# EAGLE design Layout (EAGLE 9.3.2)
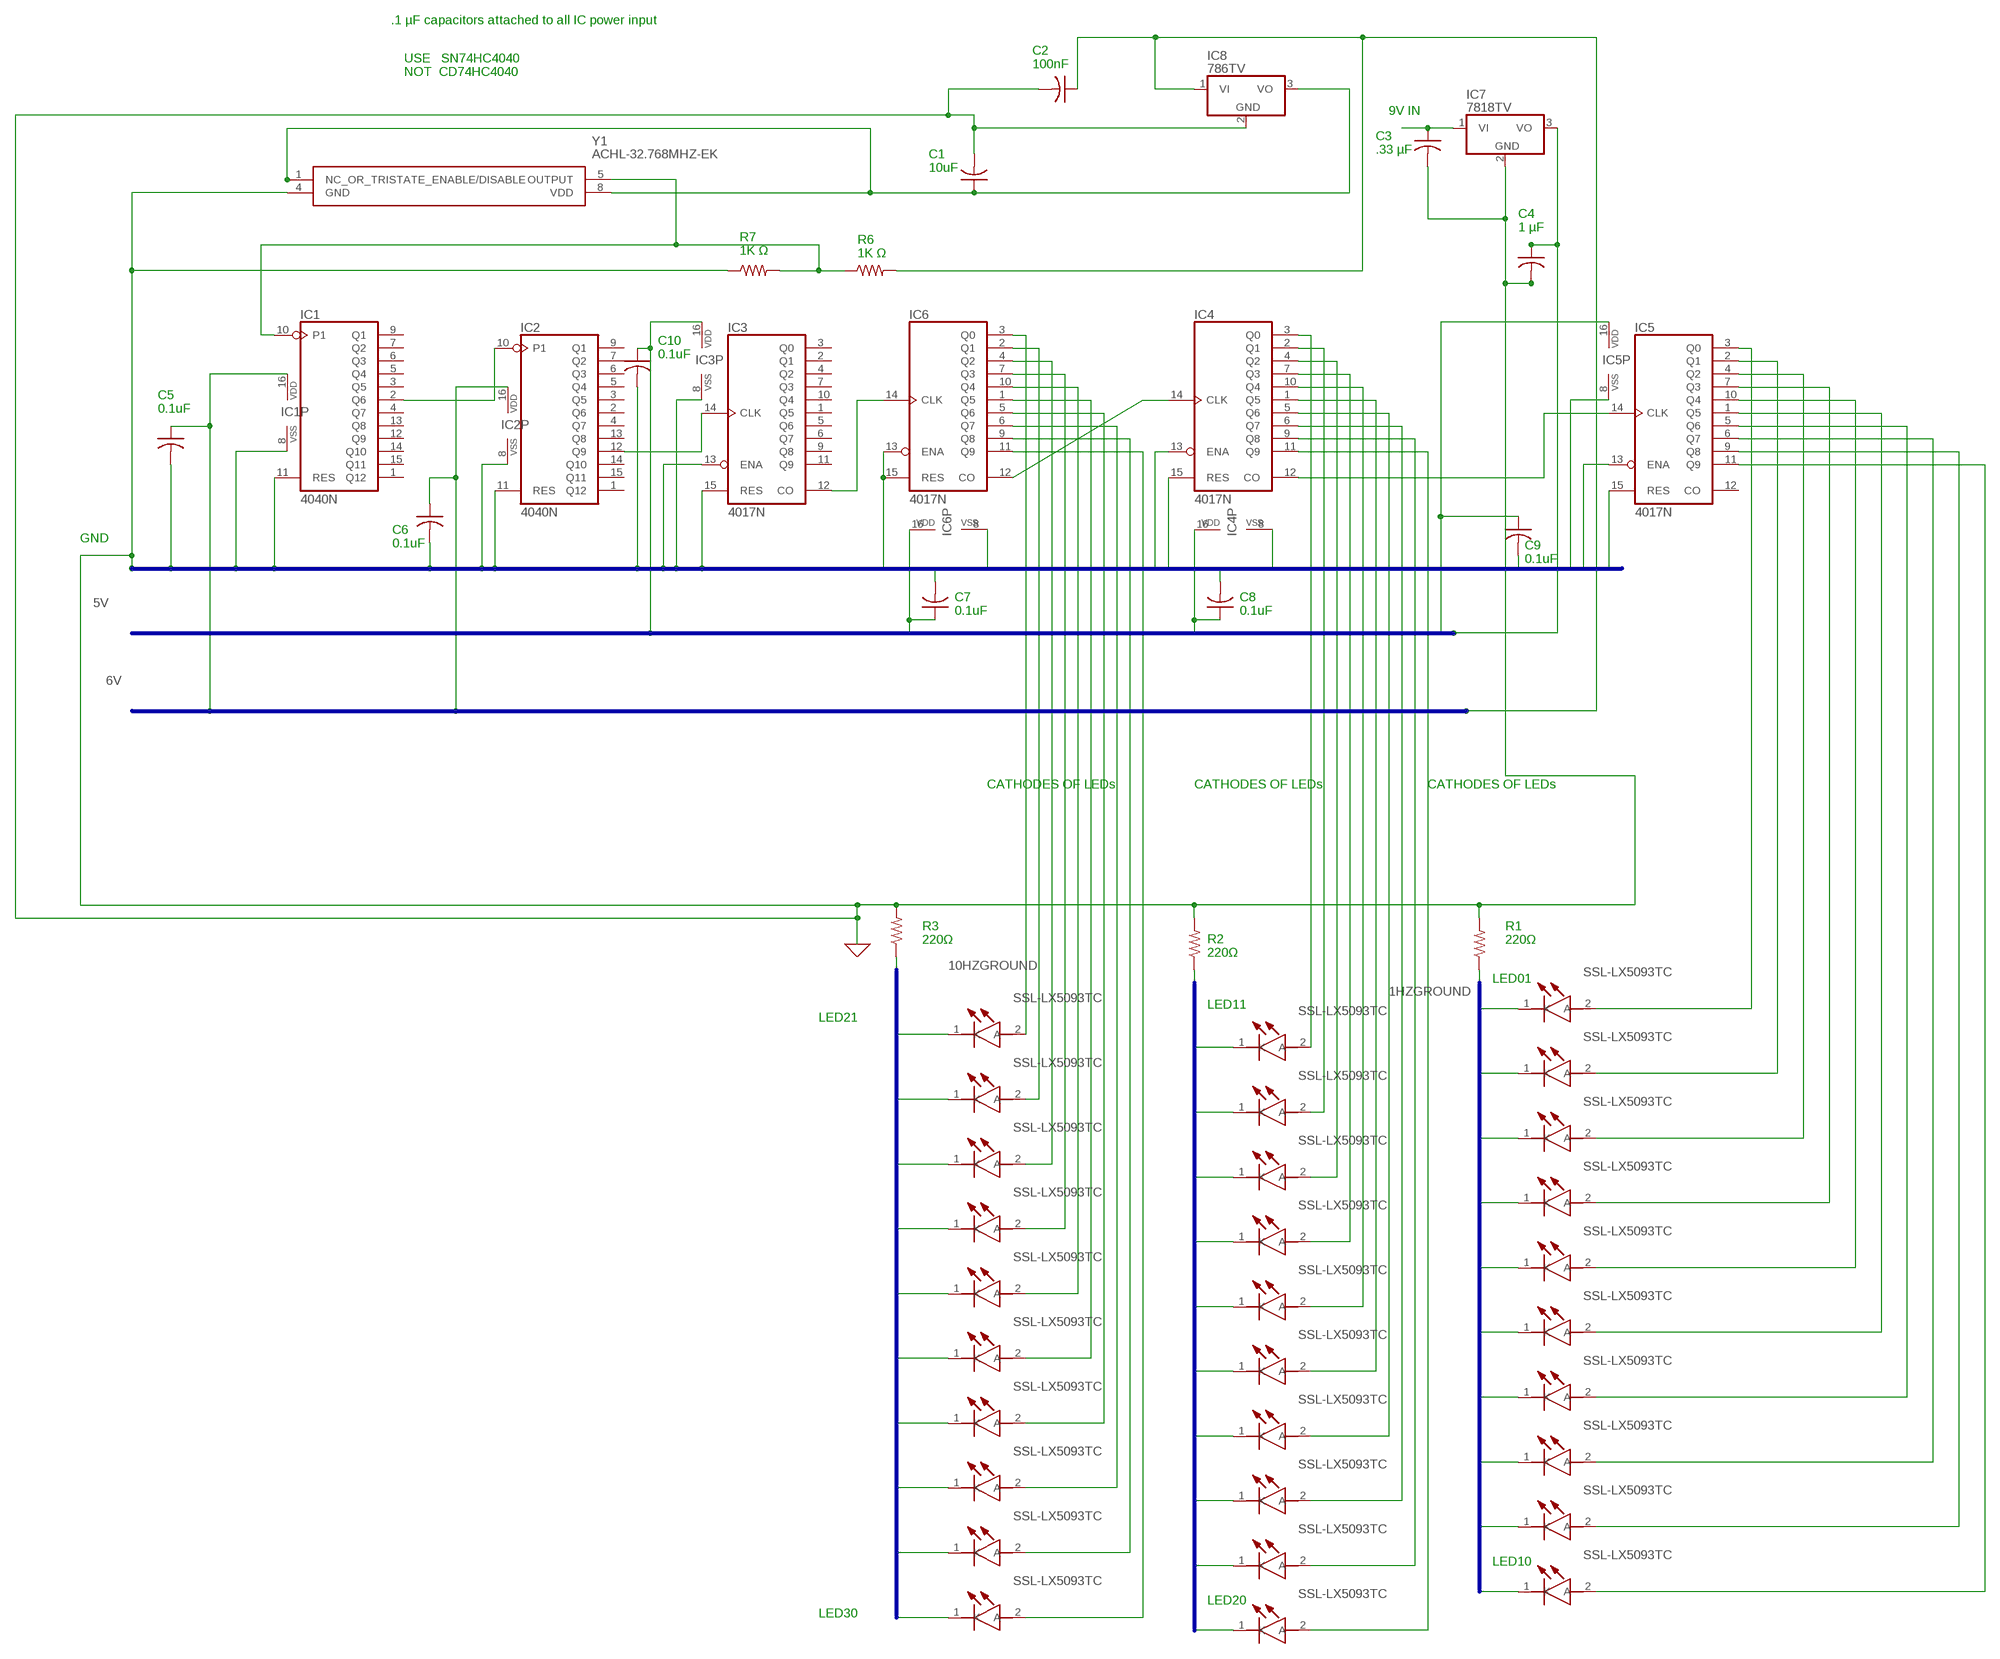
[diagram p0: schematic, sheet 1]

## Parts
C1  1uF  C-US075-063X106  [C075-063X106]
C2  .33uF  C-US075-063X106  [C075-063X106]
C3  0.33uF  C-US075-063X106  [C075-063X106]
C4  1uF  C-US075-063X106  [C075-063X106]
C5  .1uF  C-US075-063X106  [C075-063X106]
C6  .1uF  C-US075-063X106  [C075-063X106]
C7  .1uF  C-US075-063X106  [C075-063X106]
C8  .1uF  C-US075-063X106  [C075-063X106]
C9  .1uF  C-US075-063X106  [C075-063X106]
C10  .1uF  C-US075-063X106  [C075-063X106]
IC1  4040N  [DIL16]
IC2  4040N  [DIL16]
IC3  4017N  [DIL16]
IC4  4017N  [DIL16]
IC5  4017N  [DIL16]
IC6  4017N  [DIL16]
IC7  7818TV  [TO220V]
IC8  786TV  [TO220V]
LED1  SSL-LX5093TC  [SSL-LX5093SGC/B]
LED2  SSL-LX5093TC  [SSL-LX5093SGC/B]
LED3  SSL-LX5093TC  [SSL-LX5093SGC/B]
LED4  SSL-LX5093TC  [SSL-LX5093SGC/B]
LED5  SSL-LX5093TC  [SSL-LX5093SGC/B]
LED6  SSL-LX5093TC  [SSL-LX5093SGC/B]
LED7  SSL-LX5093TC  [SSL-LX5093SGC/B]
LED8  SSL-LX5093TC  [SSL-LX5093SGC/B]
LED9  SSL-LX5093TC  [SSL-LX5093SGC/B]
LED10  SSL-LX5093TC  [SSL-LX5093SGC/B]
LED11  SSL-LX5093TC  [SSL-LX5093SGC/B]
LED12  SSL-LX5093TC  [SSL-LX5093SGC/B]
LED13  SSL-LX5093TC  [SSL-LX5093SGC/B]
LED14  SSL-LX5093TC  [SSL-LX5093SGC/B]
LED15  SSL-LX5093TC  [SSL-LX5093SGC/B]
LED16  SSL-LX5093TC  [SSL-LX5093SGC/B]
LED17  SSL-LX5093TC  [SSL-LX5093SGC/B]
LED18  SSL-LX5093TC  [SSL-LX5093SGC/B]
LED19  SSL-LX5093TC  [SSL-LX5093SGC/B]
LED20  SSL-LX5093TC  [SSL-LX5093SGC/B]
LED21  SSL-LX5093TC  [SSL-LX5093SGC/B]
LED22  SSL-LX5093TC  [SSL-LX5093SGC/B]
LED23  SSL-LX5093TC  [SSL-LX5093SGC/B]
LED24  SSL-LX5093TC  [SSL-LX5093SGC/B]
LED25  SSL-LX5093TC  [SSL-LX5093SGC/B]
LED26  SSL-LX5093TC  [SSL-LX5093SGC/B]
LED27  SSL-LX5093TC  [SSL-LX5093SGC/B]
LED28  SSL-LX5093TC  [SSL-LX5093SGC/B]
LED29  SSL-LX5093TC  [SSL-LX5093SGC/B]
LED30  SSL-LX5093TC  [SSL-LX5093SGC/B]
R1  220  R-US_0207/12  [0207/12]
R2  220  R-US_0207/12  [0207/12]
R3  220  R-US_0207/12  [0207/12]
R6  1k  R-US_0309/12  [0309/12]
R7  1k  R-US_0309/12  [0309/12]
Y1  ACHL-32.768MHZ-EK  [ACHL]

## Nets
1HZGROUND: LED1.1(K) LED2.1(K) LED3.1(K) LED4.1(K) LED5.1(K) LED6.1(K) LED7.1(K) LED8.1(K) LED9.1(K) LED10.1(K) R1.1
3.3: C1.1 IC8.3(VO) Y1.1(NC_OR_TRISTATE_ENABLE/DISABLE) Y1.8(VDD)
5V: C4.1 C7.1 C8.1 C9.1 C10.1 IC3.16(VDD) IC4.16(VDD) IC5.16(VDD) IC6.16(VDD) IC7.3(VO)
6V: C2.1 C5.1 C6.1 IC1.16(VDD) IC2.16(VDD) IC8.1(VI) R6.2
9V: C3.1 IC7.1(VI)
10HZGROUND: LED11.1(K) LED12.1(K) LED13.1(K) LED14.1(K) LED15.1(K) LED16.1(K) LED17.1(K) LED18.1(K) LED19.1(K) LED20.1(K) R2.1
100HZGROUND: LED21.1(K) LED22.1(K) LED23.1(K) LED24.1(K) LED25.1(K) LED26.1(K) LED27.1(K) LED28.1(K) LED29.1(K) LED30.1(K) R3.1
C1: IC4.12(CO) IC5.14(CLK)
C1K: IC2.12(Q9) IC3.14(CLK)
C10: IC4.14(CLK) IC6.12(CO)
C32: IC1.10(P1) R6.1 R7.2 Y1.5(OUTPUT)
C100: IC3.12(CO) IC6.14(CLK)
C512: IC1.2(Q6) IC2.10(P1)
LED1: IC5.3(Q0) LED1.2(A)
LED2: IC5.2(Q1) LED2.2(A)
LED3: IC5.4(Q2) LED3.2(A)
LED4: IC5.7(Q3) LED4.2(A)
LED5: IC5.10(Q4) LED5.2(A)
LED6: IC5.1(Q5) LED6.2(A)
LED7: IC5.5(Q6) LED7.2(A)
LED8: IC5.6(Q7) LED8.2(A)
LED9: IC5.9(Q8) LED9.2(A)
LED10: IC5.11(Q9) LED10.2(A)
LED11: IC4.3(Q0) LED11.2(A)
LED12: IC4.2(Q1) LED12.2(A)
LED13: IC4.4(Q2) LED13.2(A)
LED14: IC4.7(Q3) LED14.2(A)
LED15: IC4.10(Q4) LED15.2(A)
LED16: IC4.1(Q5) LED16.2(A)
LED17: IC4.5(Q6) LED17.2(A)
LED18: IC4.6(Q7) LED18.2(A)
LED19: IC4.9(Q8) LED19.2(A)
LED20: IC4.11(Q9) LED20.2(A)
LED21: IC6.3(Q0) LED21.2(A)
LED22: IC6.2(Q1) LED22.2(A)
LED23: IC6.4(Q2) LED23.2(A)
LED24: IC6.7(Q3) LED24.2(A)
LED25: IC6.10(Q4) LED25.2(A)
LED26: IC6.1(Q5) LED26.2(A)
LED27: IC6.5(Q6) LED27.2(A)
LED28: IC6.6(Q7) LED28.2(A)
LED29: IC6.9(Q8) LED29.2(A)
LED30: IC6.11(Q9) LED30.2(A)
N$1: C1.2 C2.2 C3.2 C4.2 C5.2 C6.2 C7.2 C8.2 C9.2 C10.2 IC1.8(VSS) IC1.11(RES) IC2.8(VSS) IC2.11(RES) IC3.8(VSS) IC3.13(ENA) IC3.15(RES) IC4.8(VSS) IC4.13(ENA) IC4.15(RES) IC5.8(VSS) IC5.13(ENA) IC5.15(RES) IC6.8(VSS) IC6.13(ENA) IC6.15(RES) IC7.2(GND) IC8.2(GND) R1.2 R2.2 R3.2 R7.1 Y1.4(GND) ; supply symbol labelled GND
Unconnected: IC1.1(Q12) IC1.3(Q5) IC1.4(Q7) IC1.5(Q4) IC1.6(Q3) IC1.7(Q2) IC1.9(Q1) IC1.12(Q9) IC1.13(Q8) IC1.14(Q10) IC1.15(Q11) IC2.1(Q12) IC2.2(Q6) IC2.3(Q5) IC2.4(Q7) IC2.5(Q4) IC2.6(Q3) IC2.7(Q2) IC2.9(Q1) IC2.13(Q8) IC2.14(Q10) IC2.15(Q11) IC3.1(Q5) IC3.2(Q1) IC3.3(Q0) IC3.4(Q2) IC3.5(Q6) IC3.6(Q7) IC3.7(Q3) IC3.9(Q8) IC3.10(Q4) IC3.11(Q9) IC5.12(CO)

## Buses
N$1
5V
6V
1HZGROUND
10HZGROUND
100HZGROUND

## Notes on the sheet
- .1 µF capacitors attached to all IC power input
- C2
  100nF
- USE   SN74HC4040
  NOT  CD74HC4040
- 9V IN
- C3
  .33 µF
- C1
  10uF
- C4
  1 µF
- R7
  1K Ω
- R6
  1K Ω
- C10
  0.1uF
- C5
  0.1uF
- GND
- C6
  0.1uF
- C9
  0.1uF
- C7
  0.1uF
- C8
  0.1uF
- CATHODES OF LEDs | CATHODES OF LEDs | CATHODES OF LEDs
- R3
  220Ω
- R1
  220Ω
- R2
  220Ω
- LED01
- LED11
- LED21
- LED10
- LED20
- LED30

## Library data of the parts
C1-C4 C6-C10 = rcl:C-US: CAPACITOR, American symbol; SPICEPREFIX: C
C5 = rcl:C-US: CAPACITOR, American symbol; C5: 0.1uF; SPICEPREFIX: C
IC1 IC2 = 40xx:4040: 12-stage binary/ripple COUNTER
IC3-IC6 = 40xx:4017: COUNTER/DIVIDER
IC7 = linear:78*: Positive VOLTAGE REGULATOR Source: http://cache.national.com/ds/LM/LM78L05.pdf http://www.fairchildsemi.com/ds/LM/LM7805.pdf; SPICEPREFIX: J
IC8 = linear:78*: Positive VOLTAGE REGULATOR Source: http://cache.national.com/ds/LM/LM78L05.pdf http://www.fairchildsemi.com/ds/LM/LM7805.pdf
LED1-LED30 = SSL-LX5093TC:SSL-LX5093TC: Lumex SSL-LX5093TC Turquoise LED, 5mm (T-1 3/4) Clear, Dome Lens Through Hole Package Source: Datasheet <https://componentsearchengine.com/Datasheets/1/SSL-LX5093TC.pdf>; DESCRIPTION: Lumex SSL-LX5093TC Turquoise LED, 5mm (T-1 3/4) Clear, Dome Lens Through Hole Package; HEIGHT: mm; MANUFACTURER_NAME: Lumex; MANUFACTURER_PART_NUMBER: SSL-LX5093TC; MOUSER_PART_NUMBER: 696-SSL-LX5093TC; MOUSER_PRICE-STOCK: https://www.mouser.com/Search/Refine.aspx?Keyword=696-SSL-LX5093TC
R1-R3 R6 R7 = rcl:R-US_: RESISTOR, American symbol; SPICEPREFIX: R
Y1 = ACHL-32.768MHZ-EK:ACHL-32.768MHZ-EK: Standard Clock Oscillators 32.768MHz 3.3V Source: Datasheet <https://abracon.com/Support/PackageDrawing/Oscillators/ACHL.PDF>; DESCRIPTION: Standard Clock Oscillators 32.768MHz 3.3V; HEIGHT: mm; MANUFACTURER_NAME: ABRACON; MANUFACTURER_PART_NUMBER: ACHL-32.768MHZ-EK; MOUSER_PART_NUMBER: 815-ACHL-32.768-EK; MOUSER_PRICE-STOCK: https://www.mouser.com/Search/Refine.aspx?Keyword=815-ACHL-32.768-EK

## Board
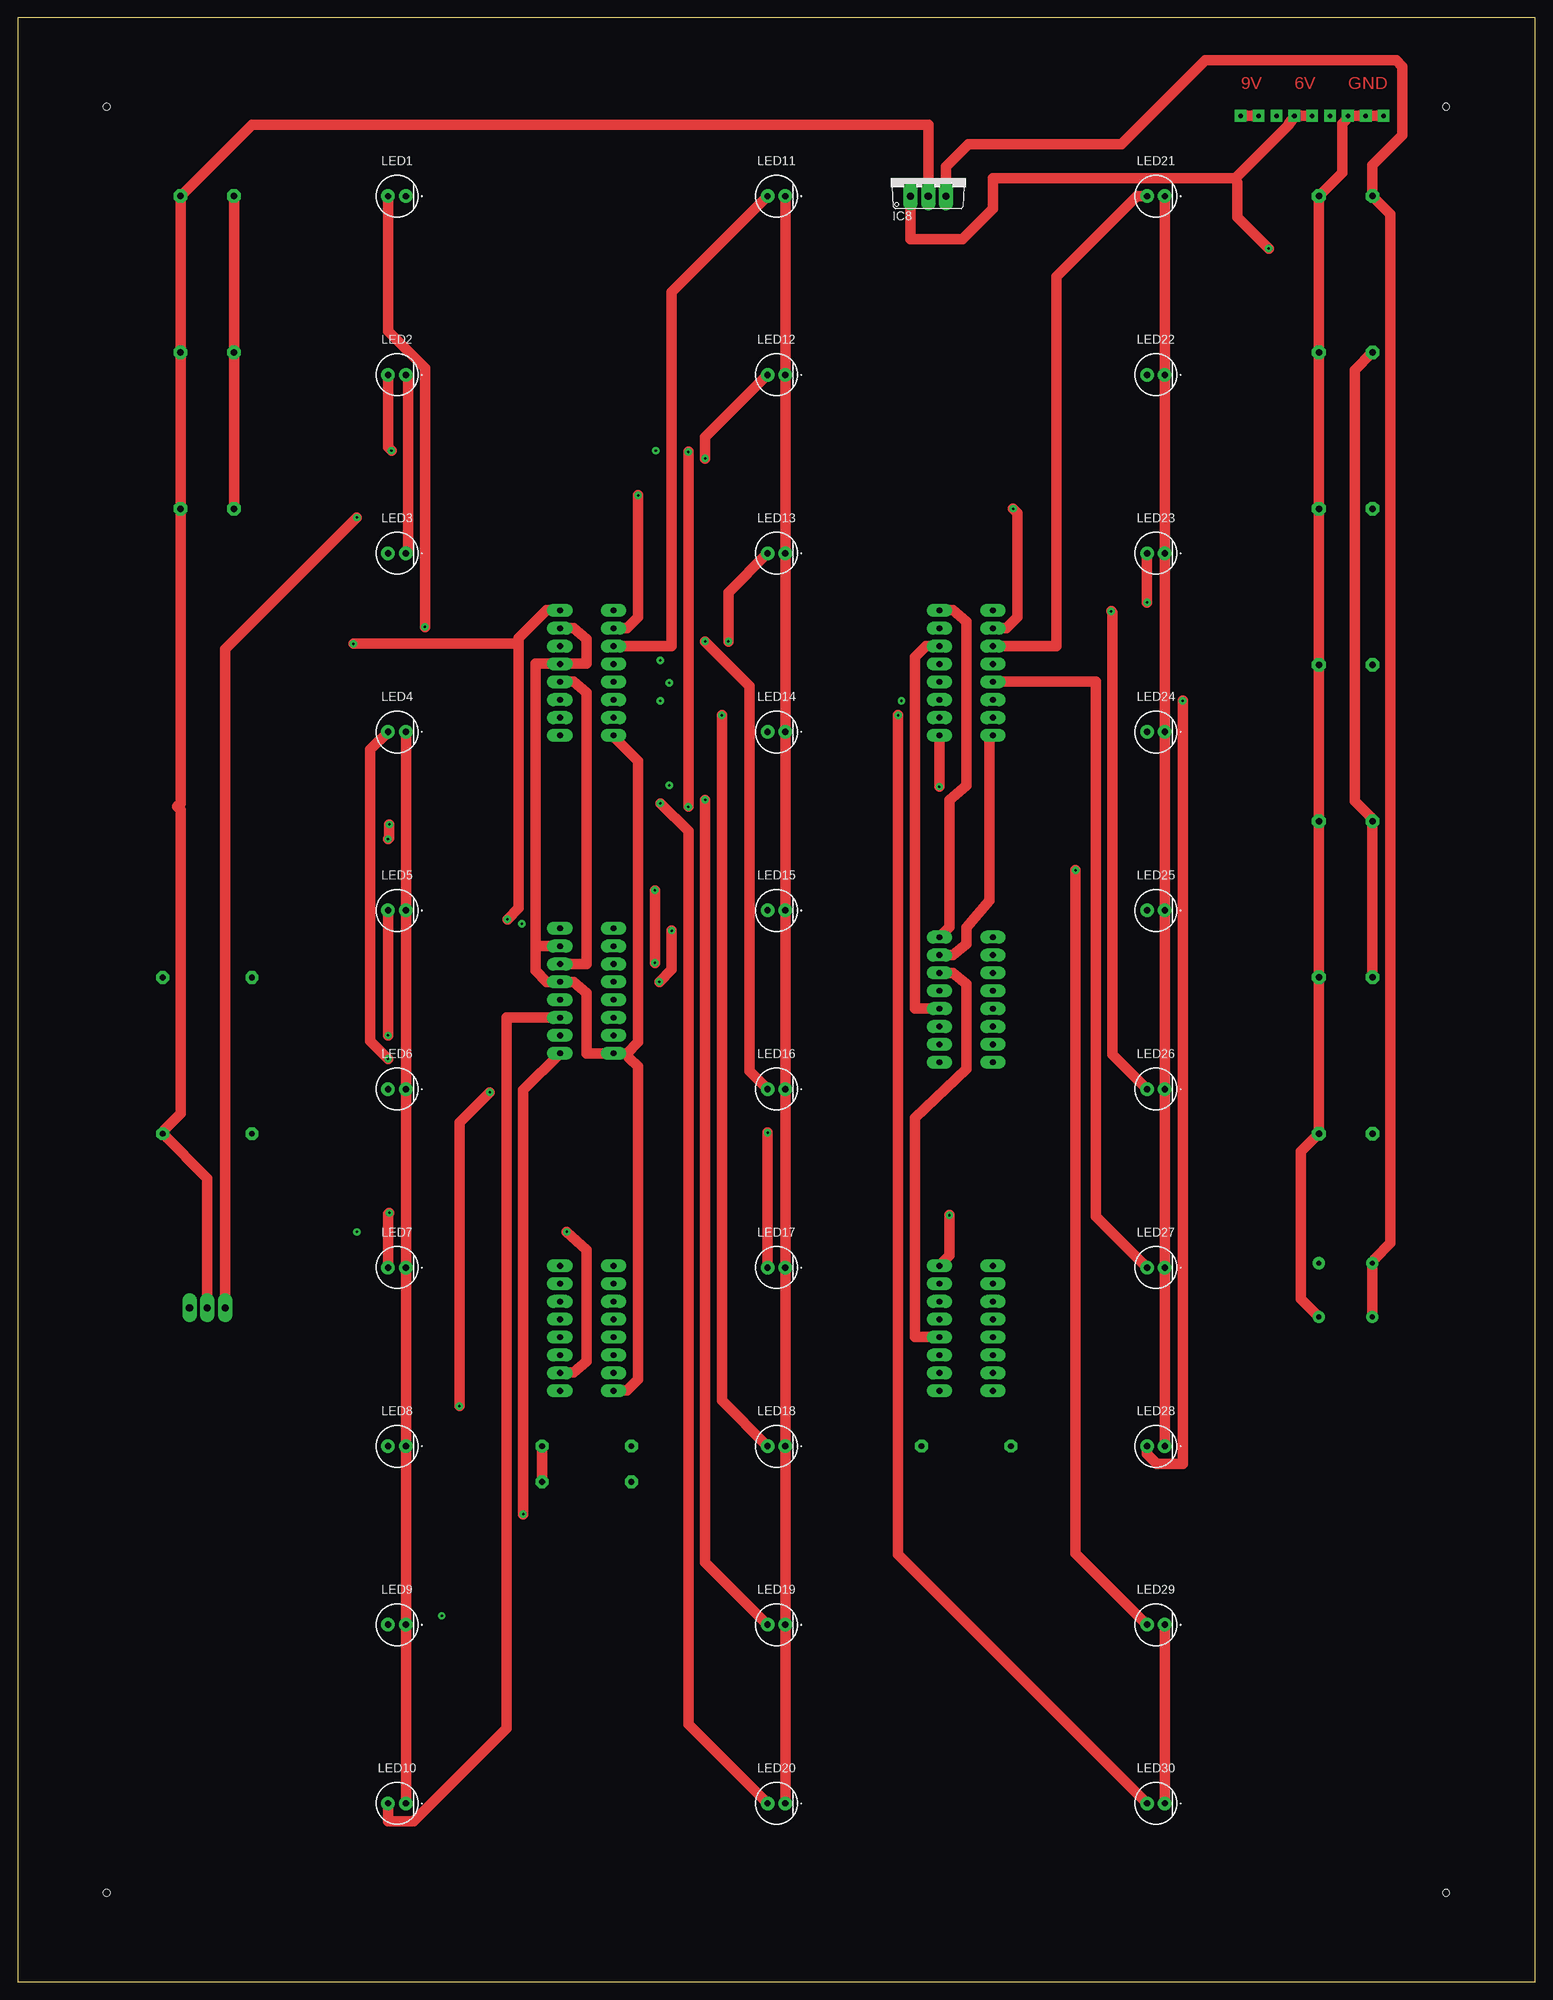
[diagram p1: board, top side]
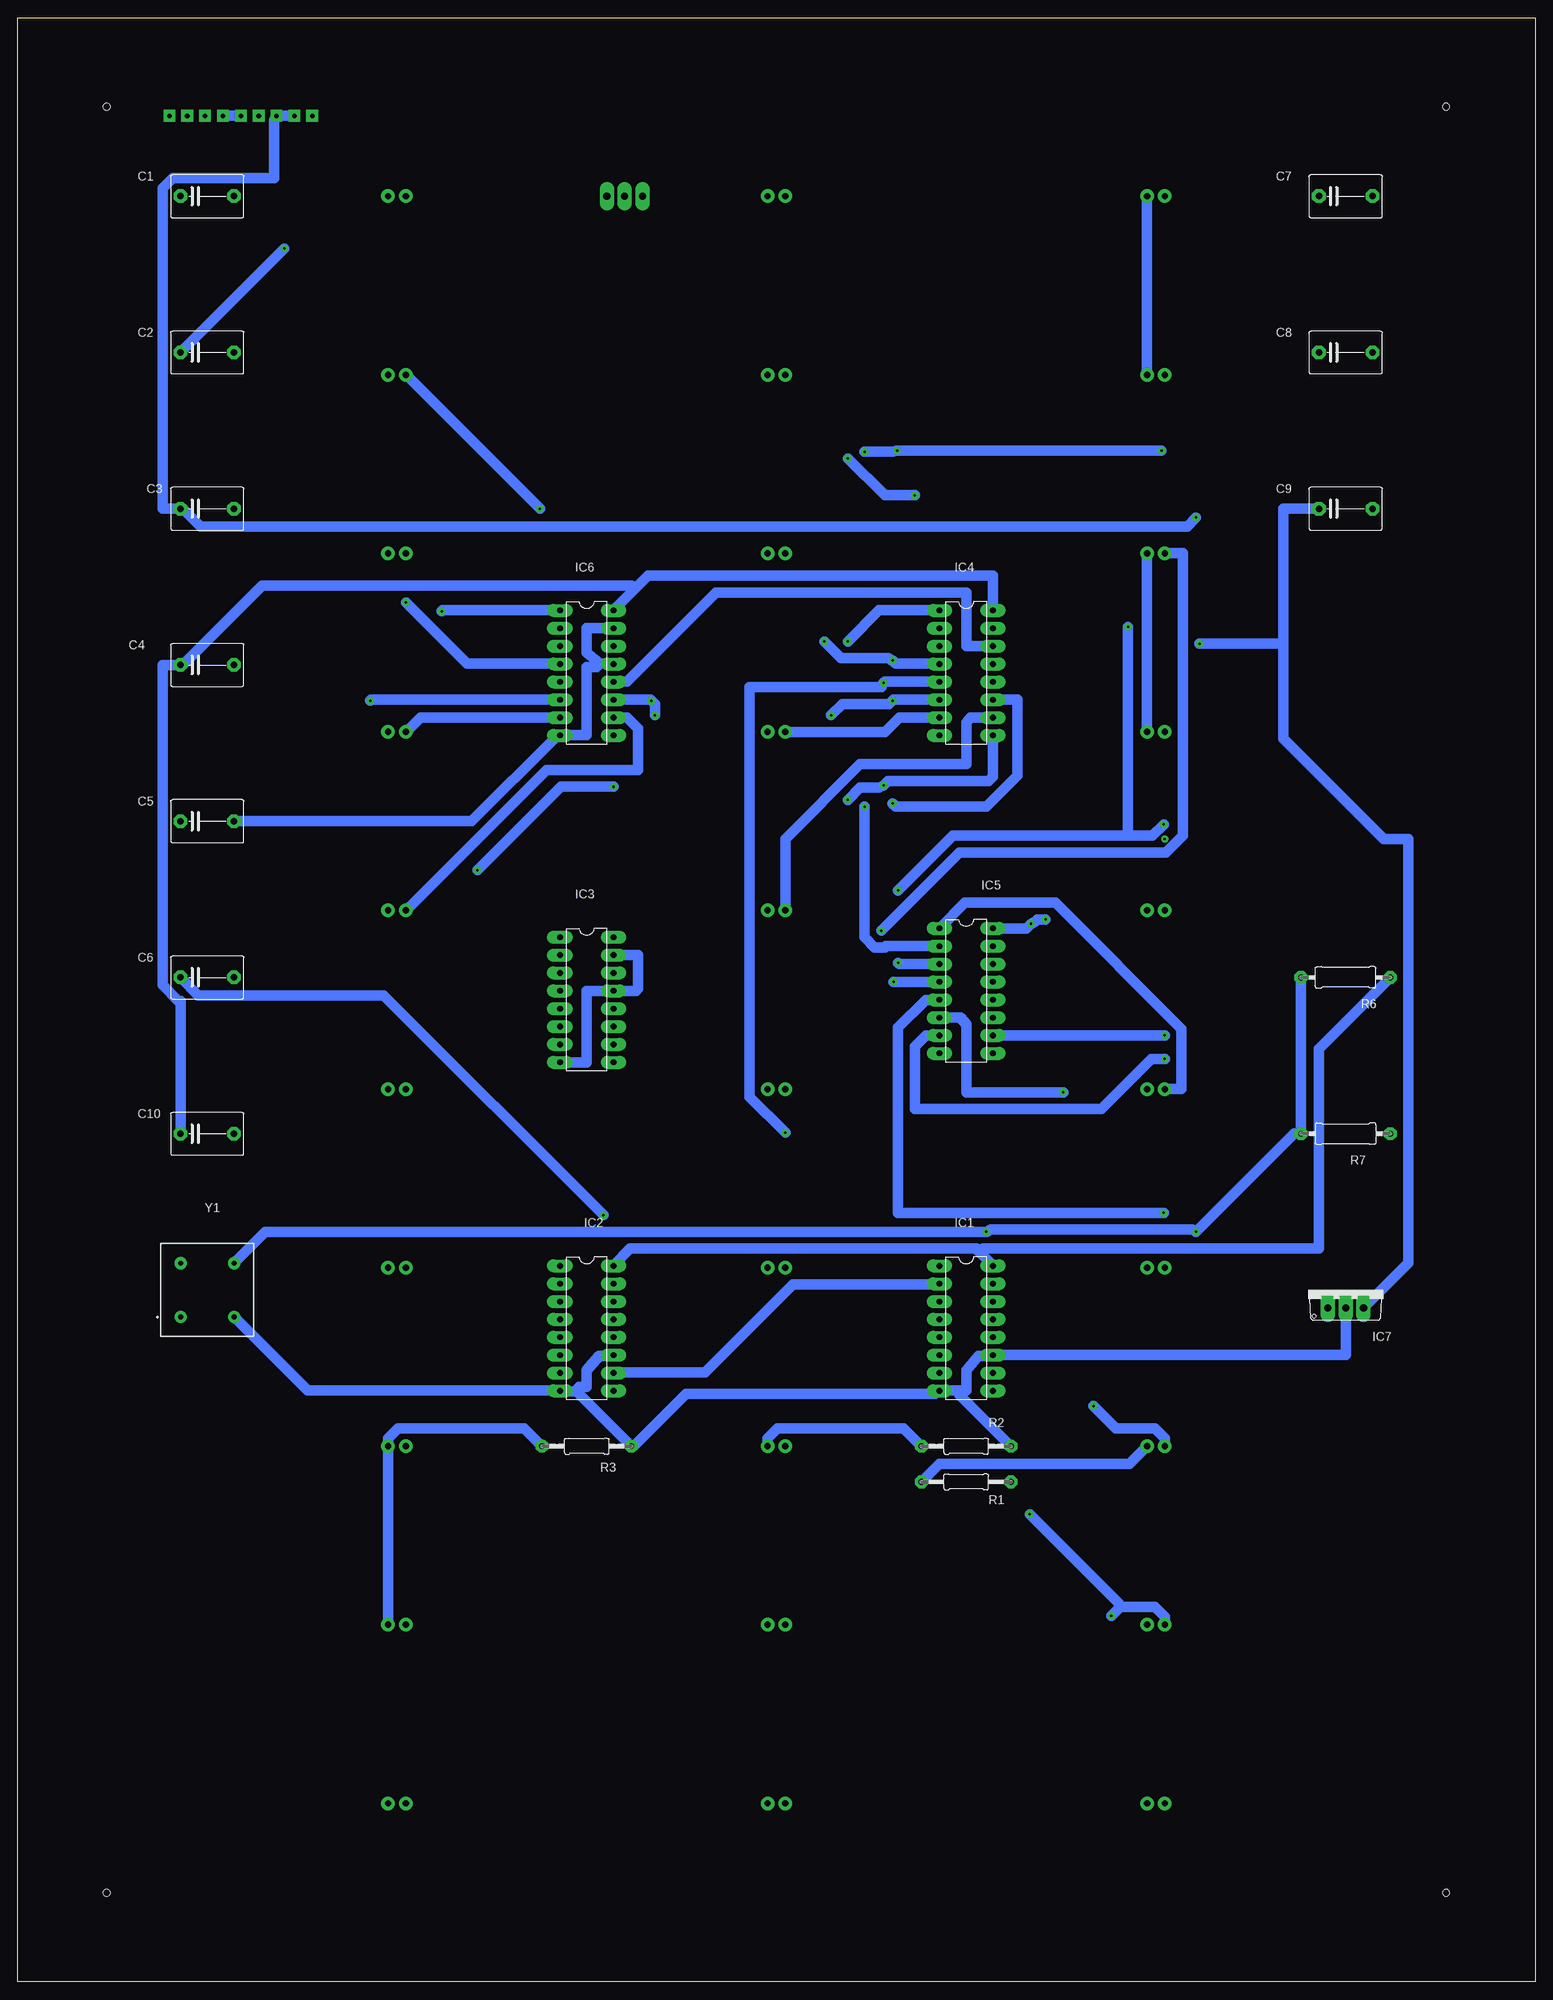
[diagram p2: board, bottom side, seen from below]

Size 215.9 x 279.4 mm. Coordinates in mm from the lower left corner, seen from the top.
Outline: 0,0 215.9,0 215.9,279.4 0,279.4 0,0
Copper layers (1*16): Top 0.035mm / dielectric 1.5mm / Bottom 0.035mm
Design rules "default *": minimum track width 60mil, minimum drill 0.35mm, track to track 30mil, track to pad 30mil, pad to pad 6mil, via to via 6mil, smd to smd 6mil, copper to edge 40mil, drill to drill 6mil, minimum pad ring 10mil, minimum via ring 8mil, stop-mask expansion 4mil, vias tented up to drill 0mil, thermal gap 10mil
Holes 1 mm at 203.2,266.7 12.7,266.7 12.7,12.7 203.2,12.7

### Footprints (pad centres in the part's own frame; a part is rotated, then mirrored left to right if it is on the bottom)
C075-063X106 = drill 0.914 octagon: 1 -3.81,0; 2 3.81,0
DIL16 = drill 0.813 long: 1 -8.89,-3.81; 2 -6.35,-3.81; 3 -3.81,-3.81; 4 -1.27,-3.81; 5 1.27,-3.81; 6 3.81,-3.81; 7 6.35,-3.81; 8 8.89,-3.81; 9 8.89,3.81; 10 6.35,3.81; 11 3.81,3.81; 12 1.27,3.81; 13 -1.27,3.81; 14 -3.81,3.81; 15 -6.35,3.81; 16 -8.89,3.81
TO220V = drill 1.016 long: 1 -2.54,-2.54; 2 0,-2.54; 3 2.54,-2.54
SSL-LX5093SGC/B = drill 0.91 pad 1.4: 1 1.27,0; 2 -1.27,0
0207/12 = drill 0.813 octagon: 1 -6.35,0; 2 6.35,0
0309/12 = drill 0.813 octagon: 1 -6.35,0; 2 6.35,0
ACHL = drill 0.7 pad 1.2: 1 -3.81,-3.81; 4 3.81,-3.81; 5 3.81,3.81; 8 -3.81,3.81

### Placement (x,y rotation side)
C1  188.91,254 0 bottom
C2  188.91,231.78 0 bottom
C3  188.91,209.55 0 bottom
C4  188.91,187.32 0 bottom
C5  188.91,165.1 0 bottom
C6  188.91,142.88 0 bottom
C7  26.99,254 0 bottom
C8  26.99,231.78 0 bottom
C9  26.99,209.55 0 bottom
C10  188.91,120.65 0 bottom
IC1  80.96,92.96 270 bottom
IC2  134.94,92.96 270 bottom
IC3  134.94,139.7 270 bottom
IC4  80.96,186.18 270 bottom
IC5  80.96,140.97 270 bottom
IC6  134.94,186.18 270 bottom
IC7  26.99,98.42 0 bottom
IC8  129.54,256.54 0 top
LED1  53.98,254 0 top
LED2  53.98,228.6 0 top
LED3  53.98,203.2 0 top
LED4  53.98,177.8 0 top
LED5  53.98,152.4 0 top
LED6  53.98,127 0 top
LED7  53.98,101.6 0 top
LED8  53.98,76.2 0 top
LED9  53.98,50.8 0 top
LED10  53.98,25.4 0 top
LED11  107.95,254 0 top
LED12  107.95,228.6 0 top
LED13  107.95,203.2 0 top
LED14  107.95,177.8 0 top
LED15  107.95,152.4 0 top
LED16  107.95,127 0 top
LED17  107.95,101.6 0 top
LED18  107.95,76.2 0 top
LED19  107.95,50.8 0 top
LED20  107.95,25.4 0 top
LED21  161.93,254 0 top
LED22  161.93,228.6 0 top
LED23  161.93,203.2 0 top
LED24  161.93,177.8 0 top
LED25  161.93,152.4 0 top
LED26  161.93,127 0 top
LED27  161.93,101.6 0 top
LED28  161.93,76.2 0 top
LED29  161.93,50.8 0 top
LED30  161.93,25.4 0 top
R1  80.96,71.12 0 bottom
R2  80.96,76.2 0 bottom
R3  134.94,76.2 0 bottom
R6  26.99,142.88 0 bottom
R7  26.99,120.65 180 bottom
Y1  188.91,98.42 0 bottom

### Tracks (layer width: path | path; a pad name or v marks a point on that pad's centre or on a via)
1HZGROUND
  Top 1.524: LED10.1 LED9.1 LED8.1 LED7.1 LED6.1 LED5.1 LED4.1 | LED2.1 55.56,228.28 55.56,203.52 LED3.1
  Bottom 1.524: R1.1 84.77,73.66 57.78,73.66 LED8.1 | LED1.1 LED2.1 | LED4.1 LED3.1
3.3
  Top 1.524: Y1.1 Y1.8 193.04,102.87 195.26,105.09 195.26,251.46 C1.1 192.72,258.39 197,262.66 197,272.43 196.1,273.32 168.96,273.32 157,261.37 135.26,261.37 132.08,258.19 IC8.3
5V  (via drill 0.35)
  Top 1.524: C9.1 C8.1 C7.1 | IC3.16 132.56,150.02 132.56,168.12 134.94,170.18 134.94,193.52 133.03,195.1 131.13,195.1 IC6.16 | v69.69,151.13 71.28,152.72 71.28,190.34 | 71.28,190.34 71.28,191.13 75.25,195.1 77.15,195.1 IC4.16 | 71.28,190.34 v47.78,190.34
  Bottom 1.524: IC7.3 18.1,102.23 18.1,162.56 21.59,162.56 35.88,176.85 35.88,190.34 | 35.88,190.34 35.88,209.55 C9.1 | C10.1 192.72,139.54 193.04,139.54 195.26,141.76 195.26,187.32 C4.1 192.09,187.64 181.13,198.6 128.59,198.6 128.11,198.12 | IC5.16 72.39,149.86 v71.75,150.5 71.12,150.81 70.8,151.13 v69.69,151.13 | IC4.16 77.15,200.03 126.21,200.03 128.11,198.12 | 128.11,198.12 131.13,195.1 IC6.16 | v47.78,190.34 35.88,190.34
6V  (via drill 0.35, 0.65)
  Top 1.524: C6.1 C5.1 192.41,165.74 190.18,167.96 190.18,229.24 C2.1 | v184.15,265.43 v181.61,265.43 181.29,264.8 180.82,264.32 180.82,264.16 173.2,256.54 | 173.2,256.54 138.75,256.54 138.75,252.25 134.4,247.9 127,247.9 IC8.1 | v177.96,246.54 173.51,250.98 173.51,255.91 173.2,256.54 | v132.56,109.06 132.56,103.35 131.13,101.92 IC2.16
  Bottom 1.524: 79.06,103.82 79.53,104.3 128.75,104.3 131.13,101.92 IC2.16 | 79.06,103.82 77.15,101.92 IC1.16 | R6.2 30.8,132.72 30.8,104.3 78.58,104.3 79.06,103.82 | v184.15,265.43 v186.69,265.43 | v177.96,246.54 C2.1 | v132.56,109.06 163.83,140.34 190.18,140.34 C6.1
9V  (via drill 0.35, 0.65)
  Top 1.524: v176.53,265.43 v173.99,265.43 | v48.26,208.28 29.53,189.55 IC7.1
  Bottom 1.524: v176.53,265.43 v179.07,265.43 179.39,264.8 179.39,256.54 193.83,256.54 195.26,255.11 195.26,209.55 C3.1 192.09,209.23 189.87,207.01 49.53,207.01 v48.26,208.28
10HZGROUND
  Top 1.524: LED20.1 LED19.1 LED18.1 LED17.1 LED16.1 LED15.1 LED14.1 LED13.1 LED12.1 LED11.1
  Bottom 1.524: R2.1 89.85,78.74 107.79,78.74 109.22,77.31 LED18.1
100HZGROUND
  Top 1.524: LED29.1 LED30.1 | LED21.1 LED22.1 LED23.1 LED24.1 LED25.1 LED26.1 LED27.1 LED28.1
  Bottom 1.524: R3.1 143.83,78.74 161.77,78.74 163.19,77.31 LED28.1 LED29.1
C1
  Top 1.524: IC5.14 80.96,144.78 80.96,183.36 79.06,184.94 77.15,184.94 IC4.12
C1K
  Top 1.524: IC3.14 133.03,143.51 134.94,141.92 134.94,129.86 127.64,122.87 127.64,91.76 131.13,91.76 IC2.12
C10
  Bottom 1.524: IC4.14 77.15,190.02 80.96,190.02 80.96,197.64 116.52,197.64 129.22,184.94 131.13,184.94 IC6.12
C32  (via drill 0.35)
  Top 1.524: v78.11,106.68 80.96,104.14 80.96,88.27 79.06,86.68 77.15,86.68 IC1.10
  Bottom 1.524: R6.1 R7.2 34.29,120.65 v48.26,106.68 48.9,107 77.47,107 v78.11,106.68 180.66,106.68 Y1.5
C100
  Top 1.524: IC3.12 127.64,138.43 127.64,188.44 129.22,190.02 131.13,190.02 IC6.14
C512
  Bottom 1.524: IC1.2 84.77,99.22 105.57,99.22 118.11,86.68 131.13,86.68 IC2.10
LED1  (via drill 0.35)
  Top 1.524: v52.7,162.56 52.86,162.72 v52.86,164.62 | v90.65,144.94 v90.65,155.26 | LED1.2 52.7,234.79 57.94,229.55 v57.94,192.72
  Bottom 1.524: v52.86,164.62 54.45,163.04 57.94,163.04 | 57.94,163.04 82.87,163.04 v90.65,155.26 | v90.65,144.94 90.49,144.78 IC5.3 | 57.94,163.04 v57.94,192.72
LED2  (via drill 0.35)
  Top 1.524: v53.18,217.81 52.7,218.28 LED2.2 | v95.41,217.65 v95.41,167.16
  Bottom 1.524: v53.18,217.81 v90.81,217.81 91.44,217.65 v95.41,217.65 | IC5.2 92.39,147.32 92.55,147.16 93.98,147.16 95.41,148.59 v95.41,167.16
LED3  (via drill 0.35)
  Top 1.524: v91.28,142.24 93.03,143.99 v93.03,149.54
  Bottom 1.524: v91.28,142.24 IC5.4 | v93.03,149.54 81.92,160.66 52.55,160.66 50.16,163.04 50.16,203.2 LED3.2
LED4  (via drill 0.35)
  Top 1.524: v52.7,131.29 50.16,133.83 50.16,175.26 LED4.2
  Bottom 1.524: IC5.7 86.68,134.62 88.27,133.03 88.27,124.14 61.75,124.14 54.61,131.29 v52.7,131.29
LED5  (via drill 0.35)
  Top 1.524: LED5.2 v52.7,134.62
  Bottom 1.524: v52.7,134.62 IC5.10
LED6
  Bottom 1.524: IC5.1 81.12,153.51 68.26,153.51 50.32,135.57 50.32,127 LED6.2
LED7  (via drill 0.35)
  Top 1.524: v52.86,109.38 52.7,109.22 LED7.2
  Bottom 1.524: IC5.5 86.68,139.7 90.65,135.73 90.65,109.38 v52.86,109.38
LED8  (via drill 0.35)
  Top 1.524: v67.15,126.52 62.87,122.24 v62.87,81.92
  Bottom 1.524: v62.87,81.92 59.69,78.74 54.13,78.74 52.7,77.31 LED8.2 | IC5.6 81.78,137.16 80.96,136.21 80.96,126.52 v67.15,126.52
LED9  (via drill 0.35)
  Top 1.524: IC5.9 71.91,126.84 v71.91,66.52
  Bottom 1.524: 59.05,53.34 v60.33,52.07 | 59.05,53.34 54.13,53.34 52.7,51.91 LED9.2 | v71.91,66.52 59.37,53.98 59.05,53.34
LED10
  Top 1.524: IC5.11 69.53,137.16 69.53,36.04 56.36,22.86 52.7,22.86 LED10.2
LED11
  Top 1.524: LED11.2 93.03,240.35 93.03,190.02 84.77,190.02 IC4.3
LED12  (via drill 0.35)
  Top 1.524: v88.27,211.46 88.27,194.15 86.68,192.56 84.77,192.56 IC4.2 | LED12.2 97.79,219.71 v97.79,216.69
  Bottom 1.524: v97.79,216.69 92.55,211.46 v88.27,211.46
LED13  (via drill 0.35)
  Top 1.524: LED13.2 101.12,197.64 v101.12,190.66
  Bottom 1.524: IC4.4 84.77,187.48 90.96,187.48 v91.44,187.96 92.08,188.28 98.74,188.28 v101.12,190.66
LED14
  Bottom 1.524: LED14.2 92.55,177.8 90.49,179.86 84.77,179.86 IC4.7
LED15
  Bottom 1.524: LED15.2 106.68,162.56 96.04,173.2 80.96,173.2 80.96,179.12 80.33,179.86 77.15,179.86 IC4.10
LED16  (via drill 0.35)
  Top 1.524: v97.79,190.66 104.14,184.31 104.14,129.54 LED16.2
  Bottom 1.524: v97.79,190.66 93.34,195.1 84.77,195.1 IC4.1
LED17  (via drill 0.35)
  Top 1.524: v106.68,120.81 LED17.2
  Bottom 1.524: IC4.5 84.77,184.94 92.55,184.94 v92.71,184.78 93.03,184.15 111.76,184.15 111.76,125.89 v106.68,120.81
LED18  (via drill 0.35)
  Top 1.524: LED18.2 100.17,82.71 v100.17,180.18
  Bottom 1.524: IC4.6 84.77,182.4 91.28,182.4 v91.44,182.25 91.92,181.77 98.58,181.77 v100.17,180.18
LED19  (via drill 0.35)
  Top 1.524: LED19.2 97.79,59.69 v97.79,168.12
  Bottom 1.524: IC4.9 77.15,171.45 77.79,170.81 92.08,170.81 v92.71,170.18 93.34,169.86 96.04,169.86 v97.79,168.12
LED20  (via drill 0.35)
  Top 1.524: LED20.2 95.41,36.67 95.41,163.67 v91.44,167.64
  Bottom 1.524: v91.44,167.64 90.96,167.16 78.11,167.16 73.66,171.61 73.66,182.4 77.15,182.4 IC4.11
LED21
  Top 1.524: LED21.2 159.23,254 147.8,242.57 147.8,190.02 138.75,190.02 IC6.3
LED22  (via drill 0.35)
  Top 1.524: v141.6,209.55 142.24,208.91 142.24,194.15 140.65,192.56 138.75,192.56 IC6.2
  Bottom 1.524: v141.6,209.55 LED22.2
LED23  (via drill 0.35)
  Top 1.524: LED23.2 v160.66,196.22
  Bottom 1.524: v160.66,196.22 151.92,187.48 138.75,187.48 IC6.4
LED24
  Bottom 1.524: LED24.2 158.59,179.86 138.75,179.86 IC6.7
LED25
  Bottom 1.524: LED25.2 140.65,172.4 127.64,172.4 127.64,178.28 129.22,179.86 131.13,179.86 IC6.10
LED26  (via drill 0.35)
  Top 1.524: LED26.2 155.73,131.92 155.73,194.79 v155.57,194.94
  Bottom 1.524: v155.57,194.94 155.42,195.1 138.75,195.1 IC6.1
LED27
  Top 1.524: LED27.2 153.35,108.9 153.35,184.94 138.75,184.94 IC6.5
LED28  (via drill 0.35)
  Top 1.524: LED28.2 160.66,75.09 162.08,73.66 165.74,73.66 v165.74,182.25
  Bottom 1.524: v165.74,182.25 165.58,182.4 138.75,182.4 IC6.6
LED29  (via drill 0.35)
  Top 1.524: IC6.9 v131.13,170.02 | LED29.2 150.5,60.96 v150.5,158.12
  Bottom 1.524: v150.5,158.12 138.59,170.02 v131.13,170.02
LED30  (via drill 0.35)
  Top 1.524: LED30.2 125.25,60.8 v125.25,180.18
  Bottom 1.524: IC6.11 131.13,182.4 125.89,182.4 v125.73,182.25 125.25,181.77 v125.25,180.18
N$1  (via drill 0.65)
  Top 1.524: IC3.15 133.03,146.05 134.94,147.64 134.94,149.98 138.27,153.83 138.27,176.69 138.75,177.16 IC6.8 | v194.31,265.43 v191.77,265.43 v189.23,265.43 188.91,264.8 188.44,264.32 188.44,257.33 C1.2 C2.2 C3.2 C4.2 C5.2 C6.2 C10.2 182.56,118.11 182.56,97.16 Y1.4 | IC7.2 26.99,114.3 R7.1 20.95,121.28 23.18,123.51 23.18,166.69 22.7,167.16 23.18,167.64 C9.2 C8.2 C7.2 33.34,264.16 129.54,264.16 IC8.2 | IC4.15 77.15,192.56 79.06,192.56 80.96,190.98 80.96,187.48 77.15,187.48 IC4.13 76.52,187.48 73.66,187.48 73.66,147.32 | 73.66,147.32 IC5.15 | 73.66,147.32 73.66,143.83 75.25,142.24 IC5.13 79.06,142.24 80.96,140.65 80.96,132.08 IC5.8 86.68,132.08 | 86.68,132.08 88.27,133.67 88.27,173.67 84.77,177.16 IC4.8 | R2.2 R1.2 | 86.68,132.08 87,131.44 88.27,130.18 88.27,85.72 86.68,84.14 84.77,84.14 IC1.8
  Bottom 1.524: 133.03,187.48 131.13,187.48 IC6.13 | 133.03,187.48 134.94,189.07 134.94,192.56 131.13,192.56 IC6.15 | 133.03,187.48 133.51,187.01 134.94,187.01 134.94,177.32 138.75,177.32 IC6.8 139.38,177.01 151.29,165.1 C5.2 | IC3.15 127.64,146.05 127.64,141.29 127.95,140.97 IC3.13 134.94,140.97 134.94,130.81 IC3.8 | 136.37,83.98 R3.2 127.95,76.52 120.81,83.66 85.41,83.66 IC1.8 84.77,84.14 81.92,84.14 | 136.37,83.98 138.75,83.98 IC2.8 139.38,84.14 174.62,84.14 Y1.4 | IC2.11 131.13,89.06 133.19,89.06 134.94,87 134.94,84.61 136.05,84.61 136.37,83.98 | 81.92,84.14 80.96,84.14 80.96,87 79.22,89.06 77.15,89.06 IC1.11 76.52,89.22 26.99,89.22 IC7.2 | R2.2 81.92,83.5 81.92,84.14

### Text on the board
Top: 9V | 6V | GND